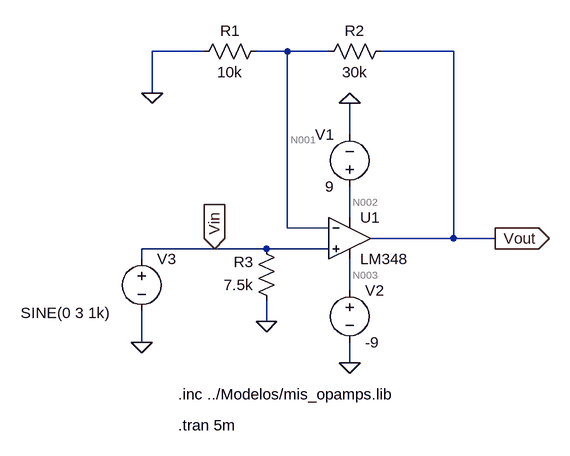
[diagram p0: schematic LM348 9v.asc]
LM348 9v.asc, the LTspice schematic file:
Version 4.1
SHEET 1 880 680
WIRE -48 -128 -128 -128
WIRE 80 -128 32 -128
WIRE 144 -128 80 -128
WIRE 336 -128 224 -128
WIRE -128 -64 -128 -128
WIRE 176 0 176 -48
WIRE 176 128 176 80
WIRE 80 144 80 -128
WIRE 144 144 80 144
WIRE 336 160 336 -128
WIRE 336 160 208 160
WIRE 400 160 336 160
WIRE -32 176 -144 176
WIRE 48 176 -32 176
WIRE 144 176 48 176
WIRE -144 192 -144 176
WIRE 176 240 176 192
WIRE 48 288 48 256
WIRE -144 320 -144 272
WIRE 176 352 176 320
FLAG 176 352 0
FLAG 176 -48 0
FLAG -32 176 Vin
IOPIN -32 176 In
FLAG 48 288 0
FLAG 400 160 Vout
IOPIN 400 160 Out
FLAG -128 -64 0
FLAG -144 320 0
SYMBOL OpAmps\\opamp2 176 96 R0
SYMATTR InstName U1
SYMATTR Value LM348
SYMBOL res 48 -144 R90
WINDOW 0 0 56 VBottom 2
WINDOW 3 32 56 VTop 2
SYMATTR InstName R1
SYMATTR Value 10k
SYMBOL res 240 -144 R90
WINDOW 0 0 56 VBottom 2
WINDOW 3 32 56 VTop 2
SYMATTR InstName R2
SYMATTR Value 30k
SYMBOL res 64 272 R180
WINDOW 0 36 76 Left 2
WINDOW 3 36 40 Left 2
SYMATTR InstName R3
SYMATTR Value 7.5k
SYMBOL voltage 176 96 R180
WINDOW 0 24 96 Left 2
WINDOW 3 24 16 Left 2
SYMATTR InstName V1
SYMATTR Value 9
SYMBOL voltage -144 176 R0
WINDOW 3 -186 99 Left 2
WINDOW 123 0 0 Left 0
WINDOW 39 0 0 Left 0
SYMATTR Value SINE(0 3 1k)
SYMATTR InstName V3
SYMBOL voltage 176 224 R0
WINDOW 123 0 0 Left 0
WINDOW 39 0 0 Left 0
SYMATTR InstName V2
SYMATTR Value -9
TEXT -88 400 Left 2 !.inc ../Modelos/mis_opamps.lib
TEXT -88 448 Left 2 !.tran 5m

The netlist it stands for:
* LM348 9v.asc
X§U1 Vin N001 N002 N003 Vout LM348  ; pins In+ In- V+ V- OUT
R1 N001 0 10k
R2 Vout N001 30k
R3 0 Vin 7.5k
V1 N002 0 9
V3 Vin 0 SINE(0 3 1k)
V2 N003 0 -9
.inc ../Modelos/mis_opamps.lib
.tran 5m
.backanno
.end

* Results of the author's LTspice run, read from the files saved beside the schematic
* Operating Point, zero values left out:
*   V(n001) = 9.457 µV
*   V(n002) = 9 V
*   V(n003) = -9 V
*   V(vout) = 935 µV
*   I(R1) = 945.7 pA
*   I(R2) = 30.85 nA
*   I(V1) = -366 µA
*   I(V2) = 366.1 µA
*   I(V3) = -29.9 nA
*   Ix(u1:1) = 29.9 nA
*   Ix(u1:2) = 29.91 nA
*   Ix(u1:3) = 366 µA
*   Ix(u1:4) = -366.1 µA
*   Ix(u1:5) = -30.85 nA
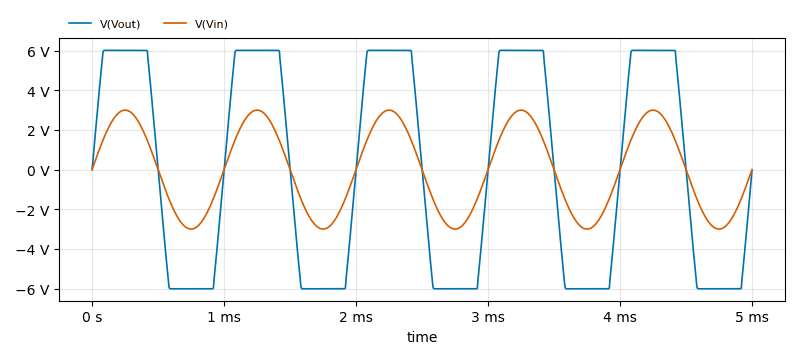
[diagram p1: Transient Analysis of LM348 9v.asc, plotted from the saved traces]
* Transient Analysis, 1 run:
*   V(Vout): min -6.013 V, max 6.014 V, average 487.4 µV, rms 5.316 V, last -34.89 mV
*   V(Vin): min -3 V, max 3 V, average 0 V, rms 2.121 V, last 0 V